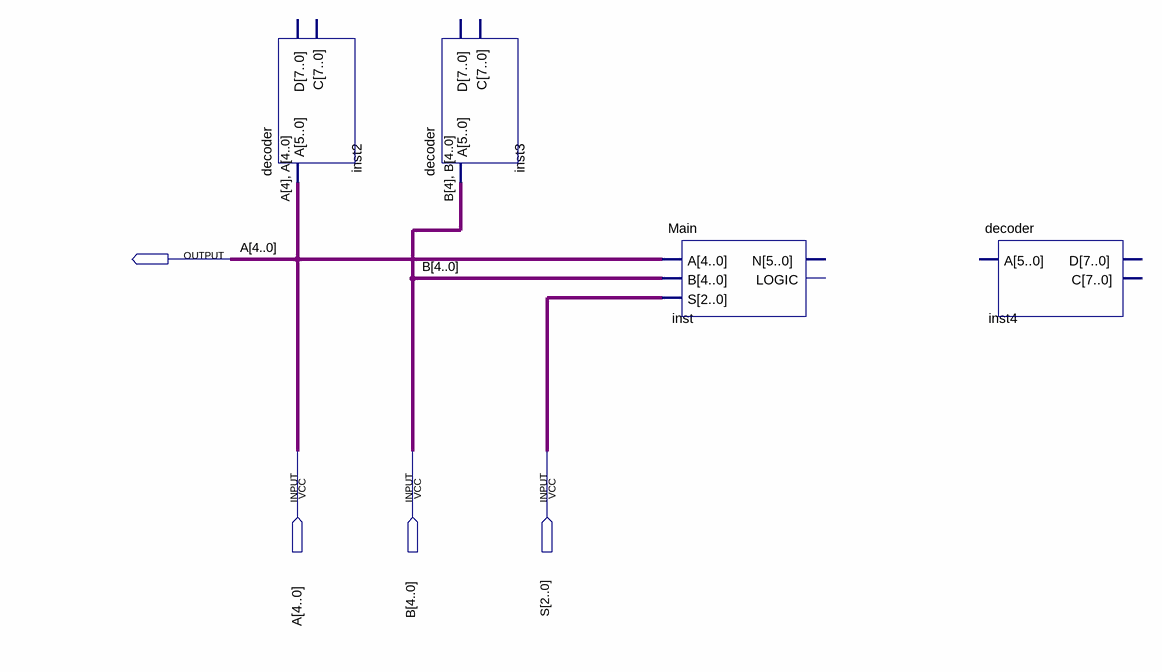
[diagram p0: schematic sheet]
// Quartus schematic mainactually.bdf as structural Verilog: 4 symbols, 4 pins
module mainactually (
  input  [4:0] A,
  input  [4:0] B,
  input  [2:0] S
);

  decoder inst2 (.A({{2{A[4]}}, A[3:0]}));  // open: D, C
  decoder inst3 (.A({{2{B[4]}}, B[3:0]}));  // open: D, C
  Main inst (.A({{2{A[4]}}, A[3:0]}), .B(B), .S(S));  // open: N, LOGIC
  decoder inst4 ();  // open: A, D, C
endmodule
